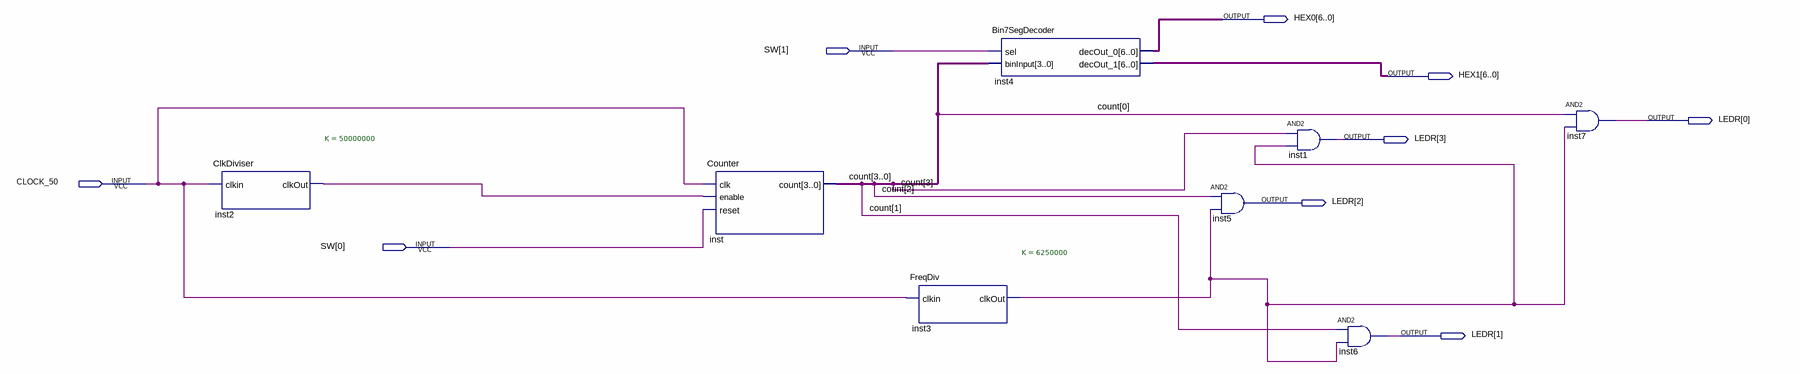
[diagram p0: schematic sheet]
// Quartus schematic MiniProjeto.bdf as structural Verilog: 8 symbols, 9 pins
module MiniProjeto (
  input  [1:0] SW,
  input  CLOCK_50,
  output [6:0] HEX0,
  output [6:0] HEX1,
  output [3:0] LEDR
);

  wire inst2_clkout, inst3_clkout;
  wire [3:0] count;

  ClkDiviser #(.K(50000000)) inst2 (.clkin(CLOCK_50), .clkOut(inst2_clkout));
  Counter inst (.clk(CLOCK_50), .enable(inst2_clkout), .reset(SW[0]), .count(count));
  FreqDiv #(.K(6250000)) inst3 (.clkin(CLOCK_50), .clkOut(inst3_clkout));
  Bin7SegDecoder inst4 (.sel(SW[1]), .binInput(count), .decOut_0(HEX0), .decOut_1(HEX1));
  and inst5 (LEDR[2], count[2], inst3_clkout);
  and inst1 (LEDR[3], count[3], inst3_clkout);
  and inst6 (LEDR[1], count[1], inst3_clkout);
  and inst7 (LEDR[0], count[0], inst3_clkout);
endmodule
